# EAGLE design USB-C_breakout (EAGLE 9.6.2)
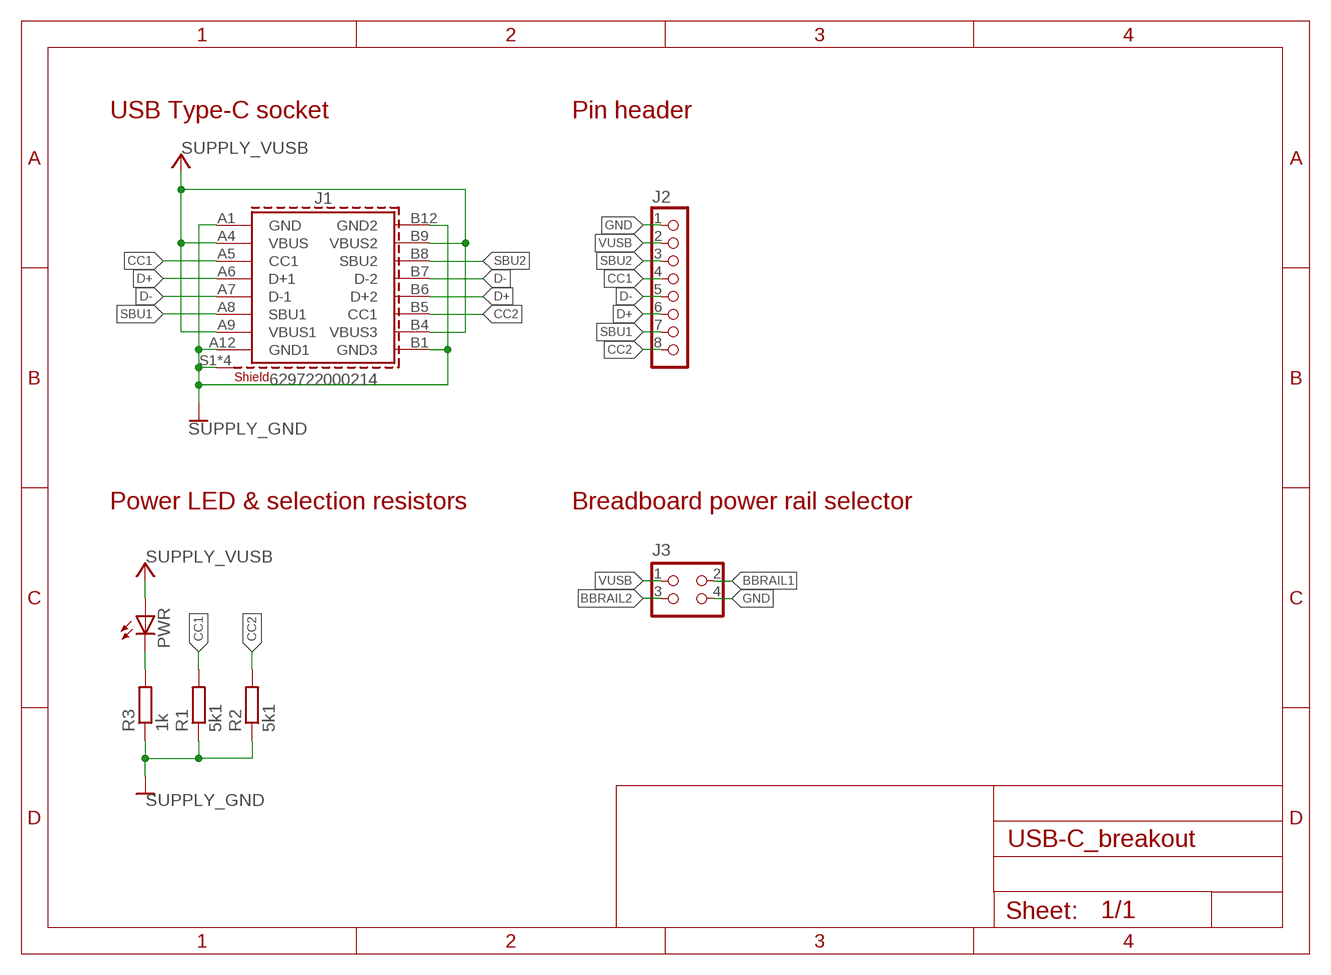
[diagram p0: schematic, sheet 1]

## Parts
J1  629722000214  [629722000214]
J2  CON_HEADER_1X08-PTH  [M1X8]
J3  CON_HEADER_2X02-PTH  [M2X2]
PWR  LED-0603  [LED-603]
R1  5k1  RESISTOR-0603  [R603]
R2  5k1  RESISTOR-0603  [R603]
R3  1k  RESISTOR-0603  [R603]

## Nets
BBRAIL1: J3.2
BBRAIL2: J3.3
CC1: J1.A5(CC1) J2.4 R1.2
CC2: J1.B5(CC1) J2.8 R2.2
D+: J1.A6(D+1) J1.B6(D+2) J2.6
D-: J1.A7(D-1) J1.B7(D-2) J2.5
GND: J1.A1(GND) J1.A12(GND1) J1.B1(GND3) J1.B12(GND2) J1.S1(SHIELD) J1.S2(SHIELD) J1.S3(SHIELD) J1.S4(SHIELD) J2.1 J3.4 R1.1 R2.1 R3.1 ; supply symbol labelled SUPPLY_GND
N$3: PWR.C R3.2
SBU1: J1.A8(SBU1) J2.7
SBU2: J1.B8(SBU2) J2.3
VUSB: J1.A4(VBUS) J1.A9(VBUS1) J1.B4(VBUS3) J1.B9(VBUS2) J2.2 J3.1 PWR.A ; supply symbol labelled SUPPLY_VUSB

## Notes on the sheet
- USB Type-C socket | Pin header
- Power LED & selection resistors | Breadboard power rail selector

## Library data of the parts
J1 = Wurth_Connectors_WR-USB:629722000214: WR-COM USB 2.0 Type C Plug Vertical SMT Kind Properties Durability 10 000 Mating cycles Gender Receptacle Type Horizontal General Information Operating Temperature -40 up to +85 °C Electrical Properties Working Voltage 20 V (DC) Withstanding Voltage 100 V (AC) Contact Resistance 40 mΩ Material Properties Insulator Material LCP Insulator Flammability Rating UL94 V-0 Insulator Color Black Contact Material Brass Contact Plating Gold over Nickel Contact Type Stamped Shielding Material Steel Shielding Plating Nickel (Ni) <https://www.we-online.com/catalog/media/o689297v209%20family-wr-com-629722000214.jpg> Details see: www.we-online.com/catalog/WR-COM_USB_20_TYPE_C_RECEPTACLE_HORIZONTAL_SMT Updated by Ella Wu 2022-05-09 2022 (C) Würth Elektronik; APPLICATION: USB 2.0; DATASHEET-URL: https://www.we-online.com/redexpert/spec/629722000214?ae; GERDER: Receptacle; INTERFACE-TYPE: Type C; IR: 5A; MOUNT: SMT; PACKAGING: Tape and Reel; PART-NUMBER: 629722000214; PINS: 16; TYPE: Horizontal; WORKING-VOLTAGE: 20V(AC)
J2 = dp_devices:CON_HEADER_1X08
J3 = dp_devices:CON_HEADER_2X02
PWR = dp_devices:LED: Light Emitting Diode
R1-R3 = dp_devices:RESISTOR

## Board
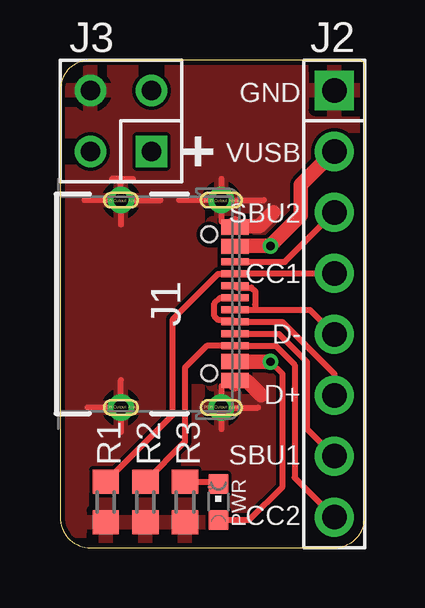
[diagram p1: board, top side]
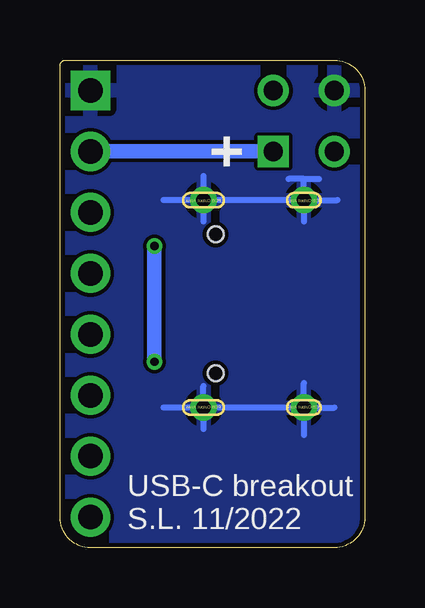
[diagram p2: board, bottom side, seen from below]

Size 12.7 x 20.32 mm. Coordinates in mm from the lower left corner, seen from the top.
Outline: 12.7,1.27 12.7,20.07 arc90 12.45,20.32 1.27,20.32 arc90 0,19.05 0,1.27 arc90 1.27,0 11.43,0 arc90 12.7,1.27
Copper layers (1*16): Top 0.035mm / dielectric 1.5mm / Bottom 0.035mm
Design rules "aisler_2_layer": minimum track width 0.1mm, minimum drill 0.2mm, track to track 0.15mm, track to pad 0.15mm, pad to pad 0.1mm, via to via 0.1mm, smd to smd 0.1mm, copper to edge 0.2mm, drill to drill 0.21mm, minimum pad ring 0.25mm, minimum via ring 0.15mm, stop-mask expansion 0mil, vias tented up to drill 0mil, thermal gap 10mil

### Footprints (pad centres in the part's own frame; a part is rotated, then mirrored left to right if it is on the bottom)
629722000214 = smd 0.3 x 1.15: A1 -3.35,4.745; A4 -2.55,4.745; A5 -1.25,4.745; A6 -0.25,4.745; A7 0.25,4.745; A8 1.25,4.745; A9 2.55,4.745; A12 3.35,4.745; B1 3.05,4.745; B4 2.25,4.745; B5 1.75,4.745; B6 0.75,4.745; B7 -0.75,4.745; B8 -1.75,4.745; B9 -2.25,4.745; B12 -3.05,4.745 | drill 0.6 pad 1: S1 -4.32,4.18; S2 4.32,4.18; S3 -4.32,0; S4 4.32,0 | hole 0.65: -2.89,3.68; 2.89,3.68
M1X8 = drill 1.02 pad 1.632 square: 1 -8.89,0 | drill 1.02 pad 1.632: 2 -6.35,0; 3 -3.81,0; 4 -1.27,0; 5 1.27,0; 6 3.81,0; 7 6.35,0; 8 8.89,0
M2X2 = drill 0.8 square: 1 -1.27,-1.27 | drill 0.8: 2 -1.27,1.27; 3 1.27,-1.27; 4 1.27,1.27
LED-603 = smd 0.8 x 0.8: A 0,-0.75; C 0,0.75
R603 = smd 1 x 1.1: 1 -0.85,0; 2 0.85,0

### Placement (x,y rotation side)
J1  2.54,10.16 270 top
J2  11.43,10.16 270 top
J3  2.54,17.78 90 top
PWR  6.6,1.9 0 top
R1  1.91,1.9 90 top
R2  3.56,1.9 90 top
R3  5.21,1.9 90 top

### Tracks (layer width: path | path; a pad name or v marks a point on that pad's centre or on a via)
CC1
  Top 0.254: J2.4 7.3,11.43 J1.A5 6.58,11.41 4.7,9.53 4.7,5.55 R1.2
CC2
  Top 0.254: J2.8 9.78,2.92 9.78,7.62 8.99,8.41 J1.B5 6.12,8.41 5.21,7.49 5.21,4.41 R2.2
D+
  Top 0.254: J2.6 11.43,7.24 9.26,9.41 J1.B6 7.21,9.48 6.59,9.48 6.43,9.64 6.43,10.18 6.67,10.41 J1.A6
D-
  Top 0.254: J1.A7 8.13,9.91 | 8.13,9.91 10.41,9.91 J2.5 | J1.B7 7.36,10.84 7.97,10.84 8.14,10.68 8.14,10.14 8.13,10.14 8.13,9.91
GND
  Top 0.254: J1.B1 7.29,6.94 6.94,6.94 6.73,6.73 6.73,5.85 J1.S2 | J1.A1 J1.B12 | J1.S3 1.02,14.48 | J1.S3 4.19,14.48 | J1.S3 2.54,13.46 | J1.S3 2.54,15.37 | 2.54,15.37 2.16,15.37 | 2.54,15.37 3.05,15.37 | J1.S1 8.51,14.48 | J1.S1 4.95,14.48 | J1.S1 6.73,15.37 | J1.S1 6.72,13.6 6.73,13.59 | J1.S2 8.25,5.84 | J1.S2 6.72,4.94 | J1.S4 2.54,6.99 | J1.S4 2.54,4.83 | J1.S4 1.15,5.84
  Top 0.61: J1.A1 7.29,13.38 8.3,13.38 8.89,13.97 | J1.A12 7.29,6.94 7.79,6.94 8.38,6.35
  Bottom 0.254: J1.S3 J1.S1 | J1.S1 8.38,14.48 | J1.S1 6.72,15.48 | J1.S1 6.73,13.59 | J1.S3 1.14,14.48 | J1.S3 2.54,15.37 | 2.54,15.37 1.91,15.37 | 2.54,15.37 3.17,15.37 | J1.S3 2.54,13.59 | J1.S4 J1.S2 | J1.S2 8.38,5.84 | J1.S2 6.73,5.85 6.73,6.73 | J1.S2 6.73,4.95 | J1.S4 1.27,5.84 | J1.S4 2.54,6.86 | J1.S4 2.54,4.7
  pour Top: 0,20.32 12.7,20.32 12.7,0 0,0
  pour Bottom: 0,20.32 12.7,20.32 12.7,0 0,0
N$3
  Top 0.254: R3.2 6.5,2.76 PWR.C
SBU1
  Top 0.254: J1.A8 9.12,8.91 10.29,7.75 10.29,4.95 J2.7
SBU2
  Top 0.254: J1.B8 9.37,11.91 J2.3
VUSB  (via drill 0.35)
  Top 0.254: J1.A4 7.29,12.57 J1.B9 | J1.B4 7.29,7.75 J1.A9 | PWR.A 7.89,1.15 9.27,2.54 9.27,7.24 v8.76,7.75
  Top 0.61: 7.29,12.57 v8.76,12.57 10.03,13.84 10.03,15.11 J2.2 | v8.76,7.75 7.29,7.75
  Bottom 0.61: v8.76,12.57 v8.76,7.75 | J3.1 J2.2

### Text on the board
tNames: + | GND / VUSB / SBU2 / CC1 / D- / D+ / SBU1 / CC2
bNames: + | USB-C breakout / S.L. 11/2022